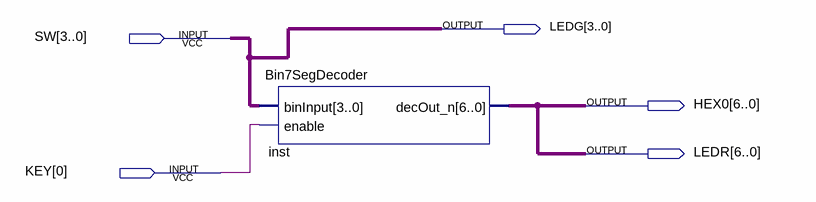
[diagram p0: schematic sheet]
// Quartus schematic DisplayDemo.bdf as structural Verilog: 1 symbols, 5 pins
module DisplayDemo (
  input  [3:0] SW,
  input  [0:0] KEY,
  output [3:0] LEDG,
  output [6:0] HEX0,
  output [6:0] LEDR
);

  Bin7SegDecoder inst (.binInput(SW), .enable(KEY[0]), .decOut_n(HEX0));

  assign LEDG = SW;
  assign LEDR = HEX0;
endmodule
